# Altium project PCB_Project1.PrjPCB
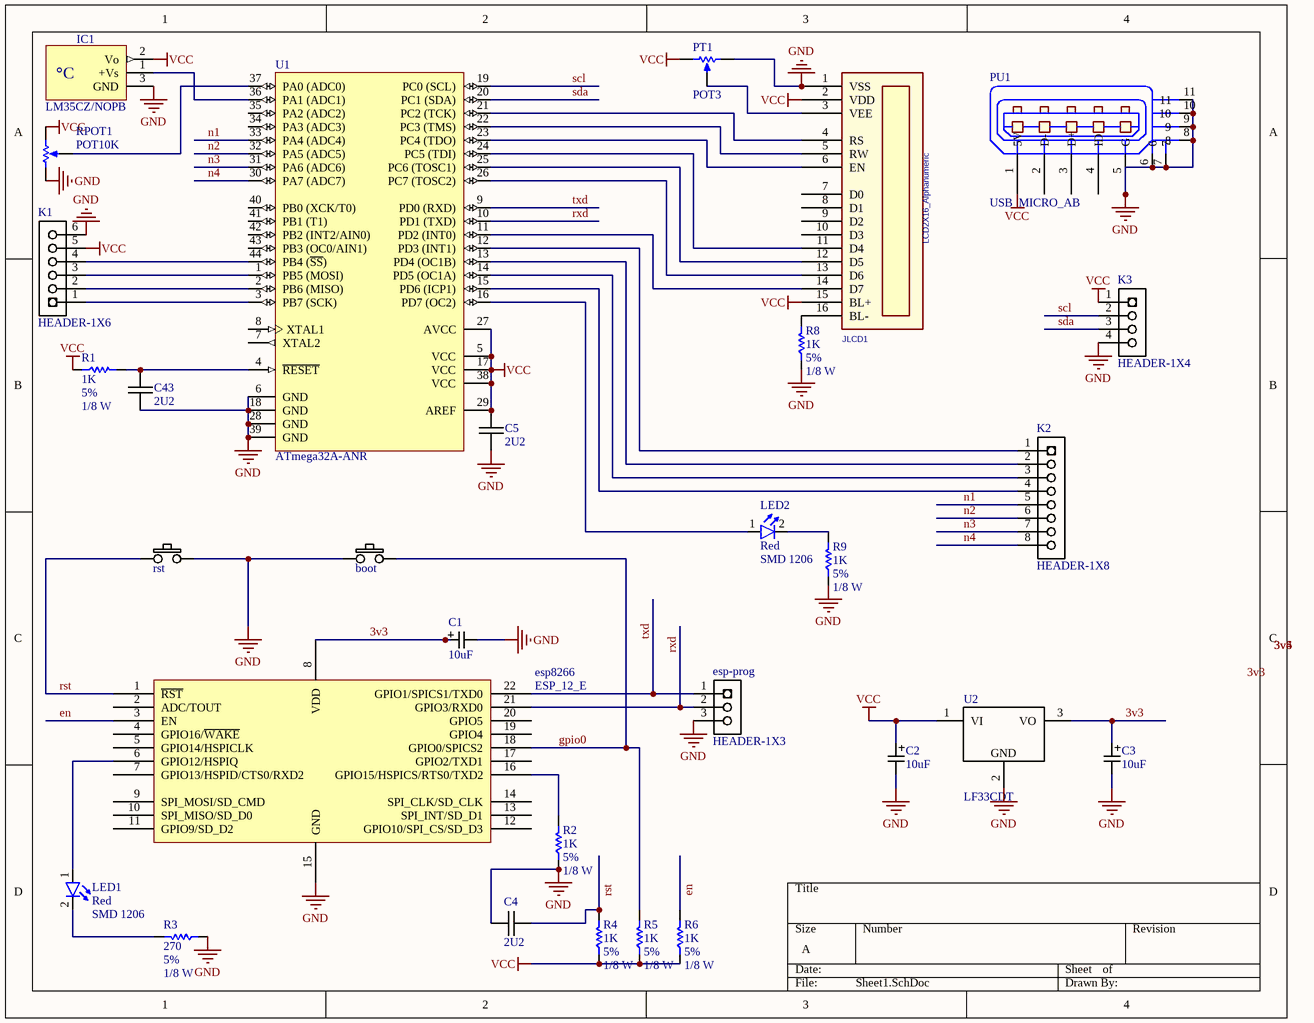
[diagram p0: Sheet1.SchDoc]
2 sheets, 30 parts. Net scope: global (net labels, ports and power ports of the same name join across sheets).
Board file: PCB12.PcbDoc
Sheets:
  Sheet1.SchDoc
  Sheet2.SchDoc

## Sheet Sheet1.SchDoc
size A

### Parts
boot  SW-PB-BLACK-SMD  [SW-PB-SMD]  (value not drawn)
C1  10uF  [CAP-B]
C2  10uF  [CAP-B]
C3  10uF  [CAP-B]
C4  2U2  [1206C-GENERIC]
C5  2U2  [1206C-GENERIC]
C43  2U2  [1206C-GENERIC]
esp8266  ESP_12_E  [ESP_12_E]
esp-prog  HEADER-1X3  [HEADER-1X3]
IC1  LM35CZ/NOPB  [TO-92AA-P127]
JLCD1  LCD2X16_Alphanumeric  [LCD_2X16]
K1  HEADER-1X6  [HEADER-1X6]
K2  HEADER-1X8  [HEADER-1X8]
K3  HEADER-1X4  [HEADER-1X4]
LED1  Size: SMD 1206  [LED SMD 1206]  (hidden comment: Red)
LED2  Size: SMD 1206  [LED SMD 1206]  (hidden comment: Red)
PT1  POT3  [POT3]
PU1  USB_MICRO_AB  [UUSB_AB_BM_SHS]
R1  Tolerance: 5%  Power: 1/8 W  [RES 1206 (3216X08L)]  (hidden comment: 1K)
R2  Tolerance: 5%  Power: 1/8 W  [RES 1206 (3216X08L)]  (hidden comment: 1K)
R3  Tolerance: 5%  Power: 1/8 W  [RES 1206 (3216X08L)]  (hidden comment: 270)
R4  Tolerance: 5%  Power: 1/8 W  [RES 1206 (3216X08L)]  (hidden comment: 1K)
R5  Tolerance: 5%  Power: 1/8 W  [RES 1206 (3216X08L)]  (hidden comment: 1K)
R6  Tolerance: 5%  Power: 1/8 W  [RES 1206 (3216X08L)]  (hidden comment: 1K)
R8  Tolerance: 5%  Power: 1/8 W  [RES 1206 (3216X08L)]  (hidden comment: 1K)
R9  Tolerance: 5%  Power: 1/8 W  [RES 1206 (3216X08L)]  (hidden comment: 1K)
RPOT1  POT10K  [VOL_R]
rst  SW-PB-BLACK-SMD  [SW-PB-SMD]  (value not drawn)
U1  ATmega32A-ANR  [44A_N]
U2  LF33CDT  [DPAK]

### Nets
GND: boot.1 C1.2 C2.2 C3.2 C4.2 C5.1 C43.1 esp8266.15(GND) esp-prog.3 IC1.3(GND) JLCD1.1(VSS) K1.6 K3.4 PT1.2(BOT) PU1.5(G) PU1.6 PU1.7 PU1.8 PU1.9 PU1.10 PU1.11 R2.1 R3.1 R8.1 R9.1 RPOT1.1(TOP) rst.2 U1.6(GND) U1.18(GND) U1.28(GND) U1.39(GND) U2.2
VCC: C2.1 C5.2 IC1.2(Vo) JLCD1.2(VDD) JLCD1.15(BL+) K1.5 K3.1 PT1.1(TOP) PU1.1(5V) R1.1 R4.1 R5.1 R6.1 RPOT1.3(BOT) U1.5(VCC) U1.17(VCC) U1.27(AVCC) U1.29(AREF) U1.38(VCC) U2.1(VI)
3v3: C1.1 C3.1 esp8266.8(VDD) U2.3(VO)
en: esp8266.3(EN) R6.2
gpio0: boot.2 esp8266.18(GPIO0/SPICS2) R5.2
n1: K2.5 U1.33(PA4_(ADC4))
n2: K2.6 U1.32(PA5_(ADC5))
n3: K2.7 U1.31(PA6_(ADC6))
n4: K2.8 U1.30(PA7_(ADC7))
rst: C4.1 esp8266.1(~{RST}) R4.2 rst.1
rxd: esp8266.21(GPIO3/RXD0) esp-prog.2 U1.10(PD1_(TXD))
scl: K3.2 U1.19(PC0_(SCL))
sda: K3.3 U1.20(PC1_(SDA))
txd: esp8266.22(GPIO1/SPICS1/TXD0) esp-prog.1 U1.9(PD0_(RXD))
NetC43_2: C43.2 R1.2 U1.4(~{RESET})
Netesp8266_6: esp8266.6(GPIO12/HSPIQ) LED1.1(A)
Netesp8266_16: esp8266.16(GPIO15/HSPICS/RTS0/TXD2) R2.2
NetIC1_1: IC1.1(+Vs) U1.36(PA1_(ADC1))
NetJLCD1_3: JLCD1.3(VEE) PT1.3(TAP)
NetJLCD1_4: JLCD1.4(RS) U1.21(PC2_(TCK))
NetJLCD1_5: JLCD1.5(RW) U1.22(PC3_(TMS))
NetJLCD1_6: JLCD1.6(EN) U1.23(PC4_(TDO))
NetJLCD1_11: JLCD1.11(D4) U1.24(PC5_(TDI))
NetJLCD1_12: JLCD1.12(D5) U1.25(PC6_(TOSC1))
NetJLCD1_13: JLCD1.13(D6) U1.26(PC7_(TOSC2))
NetJLCD1_14: JLCD1.14(D7) U1.11(PD2_(INT0))
NetJLCD1_16: JLCD1.16(BL-) R8.2
NetK1_1: K1.1 U1.3(PB7_(SCK))
NetK1_2: K1.2 U1.2(PB6_(MISO))
NetK1_3: K1.3 U1.1(PB5_(MOSI))
NetK1_4: K1.4 U1.44(PB4_(~{SS}))
NetK2_1: K2.1 U1.12(PD3_(INT1))
NetK2_2: K2.2 U1.13(PD4_(OC1B))
NetK2_3: K2.3 U1.14(PD5_(OC1A))
NetK2_4: K2.4 U1.15(PD6_(ICP1))
NetLED1_2: LED1.2(K) R3.2
NetLED2_1: LED2.1(A) U1.16(PD7_(OC2))
NetLED2_2: LED2.2(K) R9.2
NetRPOT1_2: RPOT1.2(TAP) U1.37(PA0_(ADC0))

Not connected (* = marked no-connect by the designer): esp8266 2(ADC/TOUT) 4(GPIO16/~{WAKE}) 5(GPIO14/HSPICLK) 7(GPIO13/HSPID/CTS0/RXD2) 9(SPI_MOSI/SD_CMD) 10(SPI_MISO/SD_D0) 11(GPIO9/SD_D2) 12(GPIO10/SPI_CS/SD_D3) 13(SPI_INT/SD_D1) 14(SPI_CLK/SD_CLK) 17(GPIO2/TXD1) 19(GPIO4) 20(GPIO5); JLCD1 7(D0) 8(D1) 9(D2) 10(D3); PU1 2(D-) 3(D+) 4(ID); U1 7(XTAL2) 8(XTAL1) 34(PA3_(ADC3)) 35(PA2_(ADC2)) 40(PB0_(XCK/T0)) 41(PB1_(T1)) 42(PB2_(INT2/AIN0)) 43(PB3_(OC0/AIN1))

### Notes on the sheet
- Labels drawn without touching a wire or pin: 3v3
- (in symbol LF33CDT) GND
- (in symbol LM35CZ/NOPB) °C

### Library data of the parts
boot rst = SW-PB-BLACK-SMD: PUSHBUTTON SWITCH 6MM SMD
C1-C3 = cap: tantalium capacitor; Voltage: 16V; Value: 10uF
C4 C5 C43 = 1206C-2U2-50V: CAPACITOR 0603 CERAMIC; REEL: C100; Supplier 1: Digi-Key; Supplier Part Number 1: 490-4796-2-ND
esp8266 = ESP_12_E: ESP-12 Wi-Fi Module by AI-Thinker; IC: ESP8266-EX; Vendor: Ai-thinker
IC1 = LM35CZ/NOPB: Precision Centigrade Temperature Sensor; Part Description: -55° to +150°C ±0.4°C Precision Centigrade Temperature Sensors; Manufacturer: NATIONAL SEMICONDUCTOR; Table: Sensors; Part Number: LM35CZ/NOPB; Component Kind: Standard; Component Type: Standard; Device: LM35CZ/NOPB; PackageDescription: TO-92 (TO226), Pitch 1.27mm, Flat Index, 3 In-Line, Bent Leads, Body Dia. 5.3mm; Manufacturer Part Number: LM35CZ/NOPB; Pin Count: 3; Case: TO-92; Mounted: Yes; Socket: No; SMD: No; ComponentHeight: 7.49mm; HelpURL: \\cern.ch\dfs\Applications\Altium\Datasheets\LM35CZ-NOPB.pdf; Author: CERN DEM JLC; CreateDate: 1/25/2012; LatestRevisionDate: 7/16/2012
LED1 LED2 = LED: Designer: Saeid Jorablo; Organazation: ControTec; Adding Date: 1387/12/22; Color: Red
PT1 = POT3: Variable Potentiometer top adjust; Designer: Seyed Mohsen Ghasemian; WEB: www.picpars.com
R1-R6 R8 R9 = Resistor
  R1 R2 R4-R6 R8 R9: Value: 1K
  R3: Value: 270
RPOT1 = RPot: Potentiometer; Sim Note: Enter the Resistance value and the set point into parameter fields.; Set Position: 0.5; Published: 8-Jun-2000; LatestRevisionDate: 17-Jul-2002; LatestRevisionNote: Re-released for DXP Platform.; PackageReference: VR5; Publisher: Altium Limited; PackageDescription: Variable Resistor, Thru-Hole; 3 Leads; Value: POT10K
U1 = ATmega32A-ANR: 8-bit AVR Microcontroller, 2.7-5.5V, 16MHz, 32KB Flash, 1KB EEPROM, 2KB SRAM, 44-pin TQFP, Extended Grade (-40°C to 105°C), Reel; DatasheetVersion: revC, Feb-2011; PackageVersion: revC, Oct-2010; PackageReference: 44A; PackageDescription: 44-Pin Plastic Thin Profile Quad Flat Pack, 10 x 10 x 1.0 mm Body, 0.8 mm Pitch (TQFP); Code_JEDEC: MS-026-ACB; ComponentLink1Description: Manufacturer URL; ComponentLink1URL: http://www.atmel.com/; ComponentLink2Description: ATmega32A Datasheet; ComponentLink2URL: http://www.atmel.com/dyn/resources/prod_documents/doc8155.pdf; ComponentLink3Description: ATmega32A Summary; ComponentLink3URL: http://www.atmel.com/dyn/resources/prod_documents/8155S.pdf
U2 = LF33CDT: Low Drop Voltage Regulator 3.3V; Text Field1: ST; Text Field3: Mouser; Text Field4: 511-LF33CDT; Text Field6: 0.57; Text Field2: LF33CDT; Text Field5: DPAK; NI?: *; O?: *; Section:: *
esp-prog = HEADER-1X3: Supplier 1: Digi-Key; Supplier Part Number 1: S1011E-36-ND
K1 = HEADER-1X6: Supplier 1: Digi-Key; Supplier Part Number 1: S1011E-36-ND
K2 = HEADER-1X8: Supplier 1: Digi-Key; Supplier Part Number 1: S1011E-36-ND
K3 = HEADER-1X4: Supplier 1: Digi-Key; Supplier Part Number 1: S1011E-36-ND

## Sheet Sheet2.SchDoc
size A